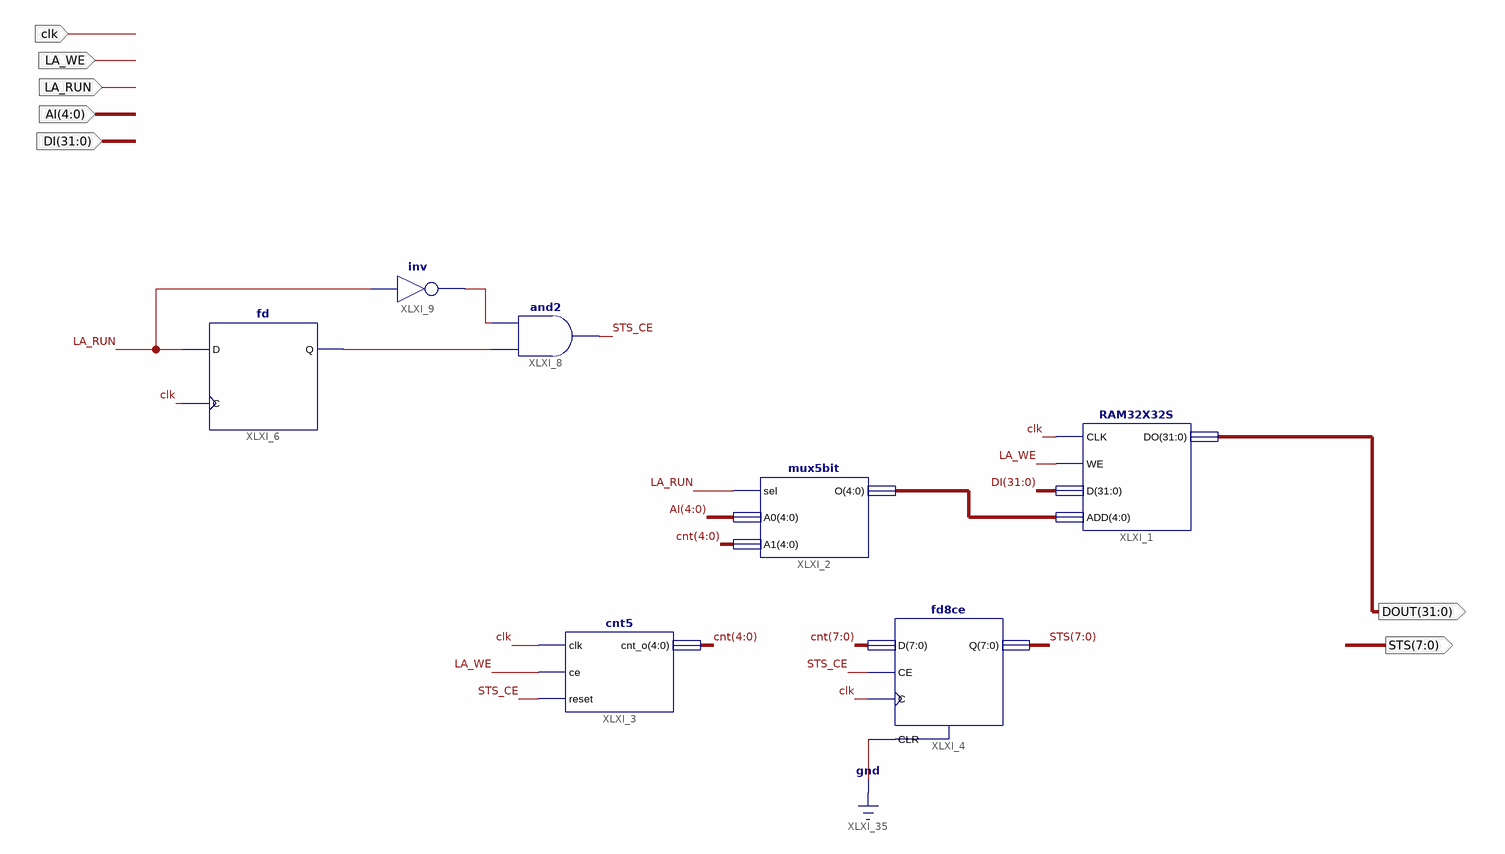
[diagram p0: schematic sheet 1]
// Xilinx ISE schematic myLogicAnalyzer.sch (spartan2) as structural Verilog: 7 symbols, 7 ports
module myLogicAnalyzer (
  input  LA_WE,
  input  [4:0] AI,
  input  [31:0] DI,
  input  LA_RUN,
  input  clk,
  output [31:0] DOUT,
  output [7:0] STS
);

  wire STS_CE, XLXN_3, XLXN_4;
  wire [4:0] XLXN_5;
  wire [7:0] cnt;

  fd XLXI_6 (.C(clk), .D(LA_RUN), .Q(XLXN_4));
  and XLXI_8 (STS_CE, XLXN_4, XLXN_3);
  not XLXI_9 (XLXN_3, LA_RUN);
  fd8ce XLXI_4 (.C(clk), .CE(STS_CE), .CLR(1'b0), .D(cnt), .Q(STS));
  cnt5 XLXI_3 (.clk(clk), .ce(LA_WE), .reset(STS_CE), .cnt_o(cnt[4:0]));
  RAM32X32S XLXI_1 (.CLK(clk), .WE(LA_WE), .D(DI), .ADD(XLXN_5), .DO(DOUT));
  mux5bit XLXI_2 (.sel(LA_RUN), .A0(AI), .A1(cnt[4:0]), .O(XLXN_5));
endmodule
